# EasyEDA Pro project SourceFile.eprj

# Schematic 双轮腿-第一次量产版本
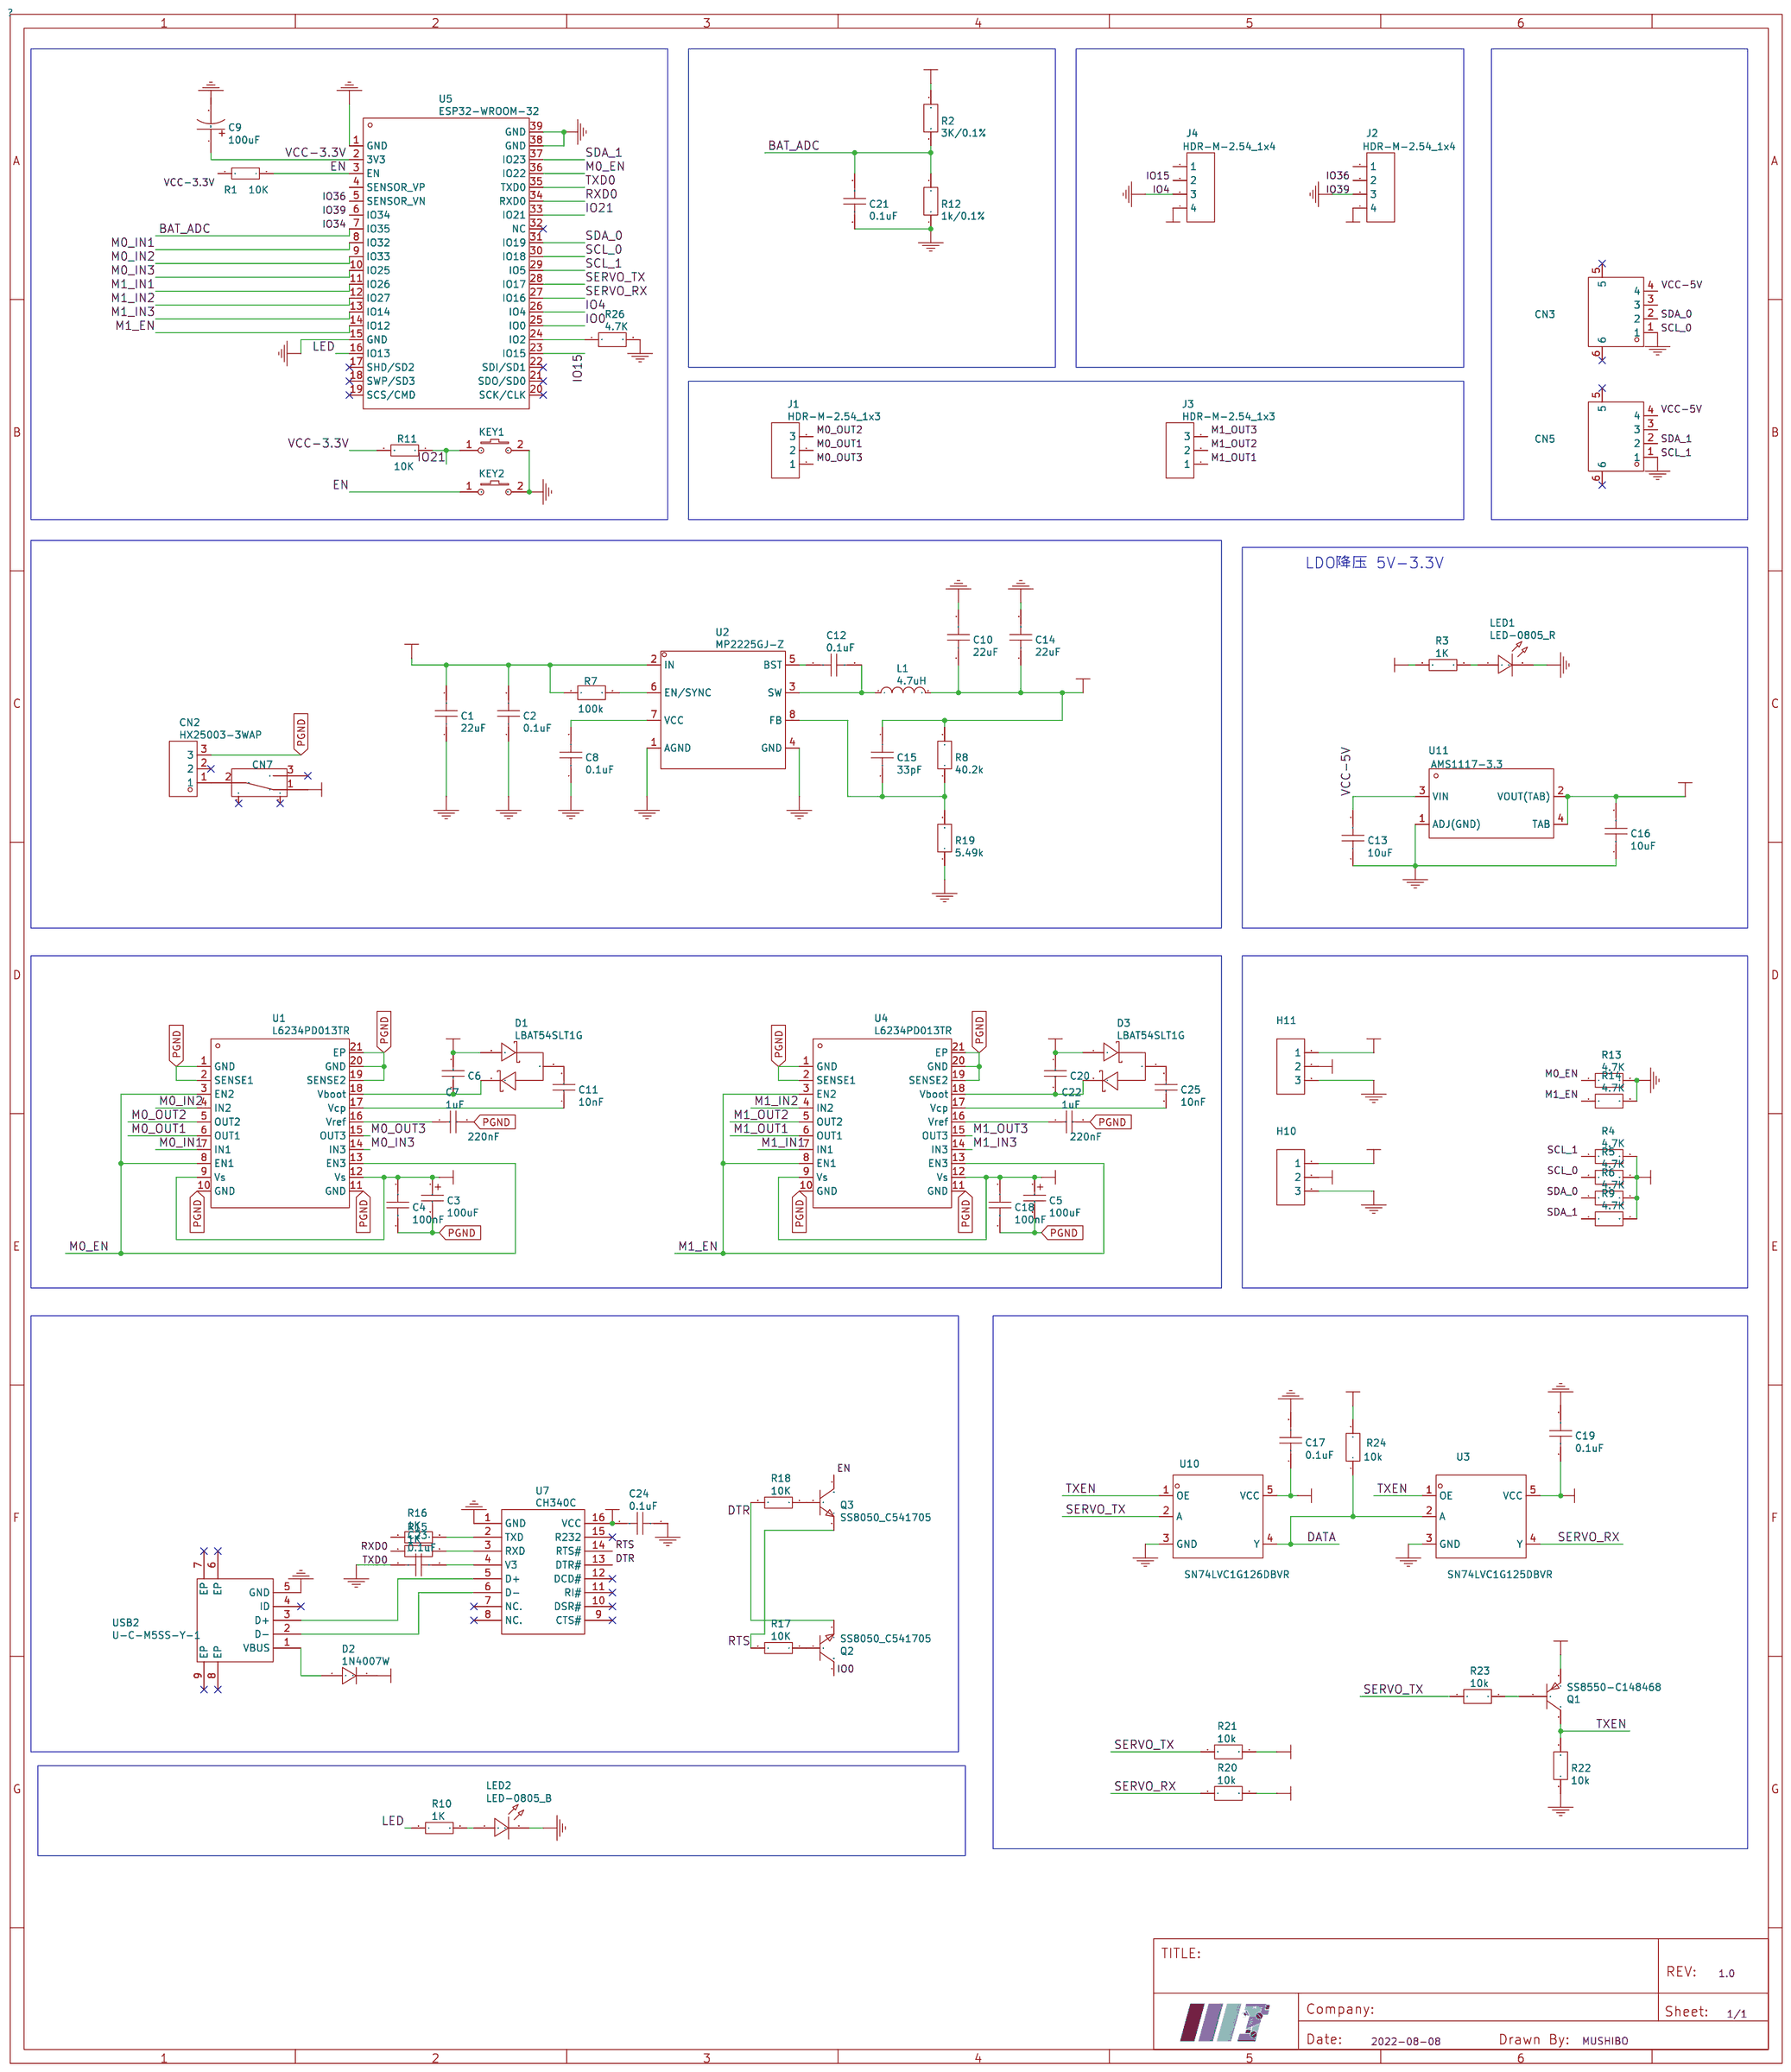
[diagram p0: schematic sheet]

## Parts
C1  22uF  [C0805]
C2  0.1uF  [C0805]
C3  100uF  [CAP-SMD_L7.3-W4.3-R-RD]
C4  100nF  [C0805]
C5  100uF  [CAP-SMD_L7.3-W4.3-R-RD]
C6  220nF  [C0805]
C7  1uF  [C0805]
C8  0.1uF  [C0805]
C9  100uF  [CAP-SMD_L3.5-W2.8-R-RD]
C10  22uF  [C0805]
C11  10nF  [C0805]
C12  0.1uF  [C0805]
C13  10uF  [C0805]
C14  22uF  [C0805]
C15  33pF  [C0805]
C16  10uF  [C0805]
C17  0.1uF  [C0805]
C18  100nF  [C0805]
C19  0.1uF  [C0805]
C20  220nF  [C0805]
C21  0.1uF  [C0805]
C22  1uF  [C0805]
C23  0.1uF  [C0805]
C24  0.1uF  [C0805]
C25  10nF  [C0805]
CN2  HX25003-3WAP  [CONN-TH_3P-P2.50_HX25003-3WAP]
CN3  A1257WV-S-4P  [CONN-SMD_A1257WV-S-4P]
CN5  A1257WV-S-4P  [CONN-SMD_A1257WV-S-4P]
CN7  SS-12D02-VG4  [SW-TH_SS-12D02-VG4]
D1  LBAT54SLT1G  [SOT-23_L2.9-W1.3-P1.90-LS2.4-BR]
D2  1N4007W  [SOD-123_L2.8-W1.8-LS3.7-RD]
D3  LBAT54SLT1G  [SOT-23_L2.9-W1.3-P1.90-LS2.4-BR]
H10  5264-3A  [CONN-TH_5264-3AW]
H11  5264-3A  [CONN-TH_5264-3AW]
J1  HDR-M-2.54_1x3  [HDR-M-2.54_1X3]
J2  HDR-M-2.54_1x4  [HDR-M-2.54_1X4]
J3  HDR-M-2.54_1x3  [HDR-M-2.54_1X3]
J4  HDR-M-2.54_1x4  [HDR-M-2.54_1X4]
KEY1  K2-3.6×6.1_SMD  [KEY-SMD_2P-L6.2-W3.6-LS8.0]
KEY2  K2-3.6×6.1_SMD  [KEY-SMD_2P-L6.2-W3.6-LS8.0]
L1  4.7uH  [IND-SMD_L7.3-W6.6]
LED1  LED-0805_R  [LED0805_RED]
LED2  LED-0805_B  [LED0805_BLUE]
Q1  SS8550-C148468  [SOT-23-3_L2.9-W1.3-P1.90-LS2.4-BR]
Q2  SS8050_C541705  [SOT-23-3_L2.9-W1.3-P1.90-LS2.4-BR]
Q3  SS8050_C541705  [SOT-23-3_L2.9-W1.3-P1.90-LS2.4-BR]
R1  10K  [R0805]
R2  3K/0.1%  [R0805]
R3  1K  [R0805]
R4  4.7K  [R0603]
R5  4.7K  [R0603]
R6  4.7K  [R0603]
R7  100k  [R0805]
R8  40.2k  [R0805]
R9  4.7K  [R0603]
R10  1K  [R0805]
R11  10K  [R0805]
R12  1k/0.1%  [R0805]
R13  4.7K  [R0603]
R14  4.7K  [R0603]
R15  1K  [R0603]
R16  1K  [R0603]
R17  10K  [R0603]
R18  10K  [R0603]
R19  5.49k  [R0805]
R20  10k  [R0805]
R21  10k  [R0805]
R22  10k  [R0805]
R23  10k  [R0805]
R24  10k  [R0805]
R26  4.7K  [R0603]
U1  L6234PD013TR  [POWERSO20_L15.9-W11.0-P1.27-LS14.2-BL-EP]
U2  MP2225GJ-Z  [TSOT-23-8_L2.9-W1.6-P0.65-LS2.8-BR]
U3  SN74LVC1G125DBVR  [SOT-23-5_L3.0-W1.7-P0.95-LS2.8-BR]
U4  L6234PD013TR  [POWERSO20_L15.9-W11.0-P1.27-LS14.2-BL-EP]
U5  ESP32-WROOM-32  [WIFIM-SMD_ESP-32S]
U7  CH340C  [SOP-16_L10.0-W3.9-P1.27-LS6.0-BL]
U10  SN74LVC1G126DBVR  [SOT-23-5_L3.0-W1.7-P0.95-LS2.8-BR]
U11  AMS1117-3.3  [SOT-223_L6.7-W3.5-P2.30-BR]
USB2  U-C-M5SS-Y-1  [MICRO-USB-SMD_U-C-M5SS-Y-1]

## Library data of the parts
C1 C10 C14 = 22uF: Supplier Part: C602037; Supplier: LCSC
C2 C8 C12 C23 C24 = 0.1uF: Supplier Part: C1525; Manufacturer: LCSC
C3 C5 = 100uF: Supplier: LCSC; Manufacturer: AVX; Manufacturer Part: TAJD107M020RNJ; Supplier Part: C99373; JLCPCB Part Class: Extended Part
C4 C18 = 100nF: Supplier: LCSC; Supplier Part: C485772; Manufacturer: HEC(Holy Stone Enterprise); Manufacturer Part: C0805X104K101T; JLCPCB Part Class: Extended Part
C6 C20 = 220nF: Supplier: LCSC; Manufacturer Part: CL21B224KBFNNNE; Manufacturer: SAMSUNG; Supplier Part: C5378; JLCPCB Part Class: Basic
C7 C22 = 1uF: Supplier: LCSC; Manufacturer Part: CL21B105KBFNNNE; Manufacturer: SAMSUNG; Supplier Part: C28323; JLCPCB Part Class: Basic
C9 = 100uF: Supplier: LCSC; Supplier Part: C140373; Manufacturer: Shenzhen Zhenhua XinYun Elec; Manufacturer Part: CA45-B-6.3V-100uF-M; JLCPCB Part Class: Extended Part
C11 C25 = 10nF: Supplier: LCSC; Manufacturer Part: CL21A106KAYNNNE; Manufacturer: SAMSUNG; Supplier Part: C15850; JLCPCB Part Class: Basic
C13 C16 = 10uF: Supplier Part: C1713; Supplier: LCSC; Manufacturer Part: CL21A106KOQNNNE; Manufacturer: SAMSUNG
C15 = 33pF: Supplier Part: C157687; Supplier: LCSC
C17 C19 C21 = 0.1uF: Supplier Part: C49678; Supplier: LCSC; Manufacturer Part: CC0805KRX7R9BB104; Manufacturer: YAGEO
CN2 = HX25003-3WAP: Supplier: LCSC; Supplier Part: C442327; Manufacturer: HX(红星); JLCPCB Part Class: Extended Part
CN3 CN5 = A1257WV-S-4P: Supplier: LCSC; Supplier Part: C225120; Manufacturer: Changjiang Connectors; JLCPCB Part Class: Extended Part
CN7 = SS-12D02-VG4: Supplier: LCSC; Supplier Part: C136719; Manufacturer: Rectangular Connectors - Contacts
D1 D3 = LBAT54SLT1G: Supplier: LCSC; Manufacturer: LRC; image: //image.lceda.cn/szlcsc/C12765.jpg; Supplier Part: C12765; JLCPCB Part Class: Extend; JLCPCB SMD: Yes
D2 = 1N4007W: Supplier: LCSC; Supplier Part: C328592; Manufacturer: BLUE ROCKET
H10 H11 = 5264-3A: Supplier Part: C146690; Supplier: LCSC
J1 J3 = HDR-M-2.54_1x3: Supplier Part: C180248; Supplier: LCSC
J2 J4 = HDR-M-2.54_1x4: Supplier Part: C124378; Supplier: LCSC
KEY1 KEY2 = K2-3.6×6.1_SMD: Supplier Part: C118141; Supplier: LCSC; Manufacturer Part: K2-1107ST-A4SW-06; 制造商: 韩国韩荣
L1 = 4.7uH: Supplier: LCSC; Supplier Part: C2937097; Manufacturer: PSA(信昌电陶); Manufacturer Part: MCS0630-4R7MPY1
LED1 = LED-0805_R: Manufacturer: EVERLIGHT(台湾亿光); Manufacturer Part: 17-21SURC/S530-A3/TR8; Supplier Part: C72037
LED2 = LED-0805_B: Manufacturer: 方舟 ARKLED; Manufacturer Part: D-B080508B1-KS2; Supplier Part: C108412
Q1 = SS8550-C148468: Supplier: LCSC; Manufacturer: Yenji; Manufacturer Part: SS8550; Supplier Part: C148468
Q2 Q3 = SS8050_C541705: Supplier: LCSC; Supplier Part: C541705; Manufacturer: AnBon; Manufacturer Part: SS8050
R1 R11 R17 R18 = 10K: Supplier: LCSC; Supplier Part: C238881; Manufacturer: Stackpole Elec; Manufacturer Part: RMCF0603JT10K0
R2 = 3K/0.1%: Supplier Part: C97164; Supplier: LCSC; Manufacturer Part: TC0525B3001T5E; Manufacturer: UniOhm
R3 R10 = 1K: Supplier: LCSC; Manufacturer: UniOhm; Manufacturer Part: 0805W8F1001T5E; Supplier Part: C17513; JLCPCB Part Class: Basic
R4-R6 R9 R13 R14 R26 = 4.7K
R7 = 100k
R8 = 40.2k
R12 = 1k/0.1%: Supplier Part: C309081; Supplier: LCSC; Manufacturer Part: ARG05BTC1001; Manufacturer: Viking Tech
R15 R16 = 1K: Supplier: LCSC; Supplier Part: C238881; Manufacturer: Stackpole Elec; Manufacturer Part: RMCF0603JT10K0
R19 = 5.49k
R20 R21 R23 R24 = 10k: Supplier Part: C17414; Supplier: LCSC; Manufacturer Part: 0805W8F1002T5E; Manufacturer: UniOhm
R22 = 10k: Supplier Part: C4328; Supplier: LCSC; Manufacturer Part: 0805W8F2002T5E; Manufacturer: UniOhm
U1 U4 = L6234PD013TR: Supplier: LCSC; Manufacturer: STMicroelectronics; Supplier Part: C77581
U2 = MP2225GJ-Z: Supplier: LCSC; Manufacturer: MPS; Supplier Part: C133066; JLCPCB Part Class: Extended Part
U3 = SN74LVC1G125DBVR: Supplier: LCSC; Manufacturer: TI; image: //image.lceda.cn/szlcsc/C23654.jpg; Supplier Part: C23654; JLCPCB Part Class: Extend
U5 = ESP32-WROOM-32: Supplier: LCSC; Supplier Part: C82899; Manufacturer: Espressif Systems; JLCPCB Part Class: Extended Part
U7 = CH340C: Supplier Part: C84681; Supplier: LCSC; Manufacturer: WCH(南京沁恒); JLCPCB Part Class: Extended Part
U10 = SN74LVC1G126DBVR: Supplier: LCSC; Manufacturer: TI; image: //image.lceda.cn/szlcsc/C23654.jpg; Supplier Part: C7834; JLCPCB Part Class: Extend
U11 = AMS1117-3.3: Supplier: LCSC; Supplier Part: C347222; Manufacturer: Youtai Semiconductor Co., Ltd.; JLCPCB Part Class: Extend
USB2 = U-C-M5SS-Y-1: Supplier: LCSC; Manufacturer: 韩国韩荣; Supplier Part: C141385; JLCPCB Part Class: Extended Part

## Nets
GND: C1.1 C2.1 C8.1 C9.2 C10.1 C13.1 C14.2 C16.1 C17.2 C19.2 C21.1 C23.2 C24.1 CN3.1 CN5.1 H10.3 H11.3 J2.3 J4.3 KEY1.2 KEY2.2 LED1.2 LED2.2 R12.1 R13.2 R14.2 R19.1 R22.1 R26.2 U2.1(AGND) U2.4(GND) U3.3(GND) U5.1(GND) U5.15(GND) U5.38(GND) U5.39(GND) U7.1(GND) U10.3(GND) U11.1(ADJ(GND)) USB2.5(GND)
PGND: C3.2 C4.1 C5.2 C7.2 C18.1 C22.2 CN2.3 U1.1(GND) U1.2(SENSE1) U1.10(GND) U1.11(GND) U1.19(SENSE2) U1.20(GND) U1.21(EP) U4.1(GND) U4.2(SENSE1) U4.10(GND) U4.11(GND) U4.19(SENSE2) U4.20(GND) U4.21(EP)
VCC-3.3V: C9.1 C16.2 C17.1 C19.1 C24.2 Q1.2(E) R1.2 R3.1 R4.2 R5.2 R6.2 R9.2 R11.2 R20.2 R21.1 R24.2 U3.5(VCC) U5.2(3V3) U7.16(VCC) U10.5(VCC) U11.2(VOUT(TAB)) U11.4(TAB)
VCC-5V: C10.2 C13.2 C14.1 C15.1 CN3.4 CN5.4 D2.1 J2.4 J4.4 L1.2 R8.2 U11.3(VIN)
VIN: C1.2 C2.2 C3.1 C4.2 C5.1 C6.1 C18.2 C20.1 CN7.1 D1.1(A) D3.1(A) H10.2 H11.2 R2.2 R7.1 U1.9(Vs) U1.12(Vs) U2.2(IN) U4.9(Vs) U4.12(Vs)
BAT_ADC: C21.2 R2.1 R12.2 U5.7(IO35)
DATA: H10.1 H11.1 R24.1 U3.2(A) U10.4(Y)
DTR: Q2.2(E) R18.2 U7.13(DTR#)
EN: KEY2.1 Q3.3(C) R1.1 U5.3(EN)
IO0: Q2.3(C) U5.25(IO0)
IO4: J4.2 U5.26(IO4)
IO15: J4.1 U5.23(IO15)
IO21: KEY1.1 R11.1 U5.33(IO21)
IO34: U5.6(IO34)
IO36: J2.1 U5.4(SENSOR_VP)
IO39: J2.2 U5.5(SENSOR_VN)
LED: R10.1 U5.16(IO13)
M0_EN: R13.1 U1.3(EN2) U1.8(EN1) U1.13(EN3) U5.36(IO22)
M0_IN1: U1.7(IN1) U5.8(IO32)
M0_IN2: U1.4(IN2) U5.9(IO33)
M0_IN3: U1.14(IN3) U5.10(IO25)
M0_OUT1: J1.2 U1.6(OUT1)
M0_OUT2: J1.3 U1.5(OUT2)
M0_OUT3: J1.1 U1.15(OUT3)
M1_EN: R14.1 U4.3(EN2) U4.8(EN1) U4.13(EN3) U5.14(IO12)
M1_IN1: U4.7(IN1) U5.11(IO26)
M1_IN2: U4.4(IN2) U5.12(IO27)
M1_IN3: U4.14(IN3) U5.13(IO14)
M1_OUT1: J3.1 U4.6(OUT1)
M1_OUT2: J3.2 U4.5(OUT2)
M1_OUT3: J3.3 U4.15(OUT3)
RTS: Q3.2(E) R17.2 U7.14(RTS#)
RXD0: R16.1 U5.34(RXD0)
SCL_0: CN3.2 R5.1 U5.30(IO18)
SCL_1: CN5.2 R4.1 U5.29(IO5)
SDA_0: CN3.3 R6.1 U5.31(IO19)
SDA_1: CN5.3 R9.1 U5.37(IO23)
SERVO_RX: R20.1 U3.4(Y) U5.27(IO16)
SERVO_TX: R21.2 R23.1 U5.28(IO17) U10.2(A)
TXD0: R15.1 U5.35(TXD0)
TXEN: Q1.3(C) R22.2 U3.1(OE) U10.1(OE)
CN2_1: CN2.1 CN7.2
D1_3: C11.2 D1.3(AK)
D3_3: C25.2 D3.3(AK)
Q1_1: Q1.1(B) R23.2
R3_2: LED1.1 R3.2
R10_2: LED2.1 R10.2
R17_1: Q2.1(B) R17.1
R18_1: Q3.1(B) R18.1
U1_16: C7.1 U1.16(Vref)
U1_17: C11.1 U1.17(Vcp)
U1_18: C6.2 D1.2(K) U1.18(Vboot)
U2_3: C12.1 L1.1 U2.3(SW)
U2_5: C12.2 U2.5(BST)
U2_6: R7.2 U2.6(EN/SYNC)
U2_7: C8.2 U2.7(VCC)
U2_8: C15.2 R8.1 R19.2 U2.8(FB)
U4_16: C22.1 U4.16(Vref)
U4_17: C25.1 U4.17(Vcp)
U4_18: C20.2 D3.2(K) U4.18(Vboot)
U5_24: R26.1 U5.24(IO2)
U7_2: R16.2 U7.2(TXD)
U7_3: R15.2 U7.3(RXD)
U7_4: C23.1 U7.4(V3)
USB2_1: D2.2 USB2.1(VBUS)
USB2_2: U7.6(D-) USB2.2(D-)
USB2_3: U7.5(D+) USB2.3(D+)

Not connected (* = marked no-connect by the designer): CN2 2*; CN3 5* 6*; CN5 5* 6*; CN7 3* 4* 5*; U5 17(SHD/SD2)* 18(SWP/SD3)* 19(SCS/CMD)* 20(SCK/CLK)* 21(SDO/SD0)* 22(SDI/SD1)* 32(NC)*; U7 7(NC.)* 8(NC.)* 9(CTS#)* 10(DSR#)* 11(RI#)* 12(DCD#)* 15(R232)*; USB2 4(ID)* 6(EP)* 7(EP)* 8(EP)* 9(EP)*

## Notes on the sheet
- LDO降压 5V-3.3V

# Board PCB_WLRobot
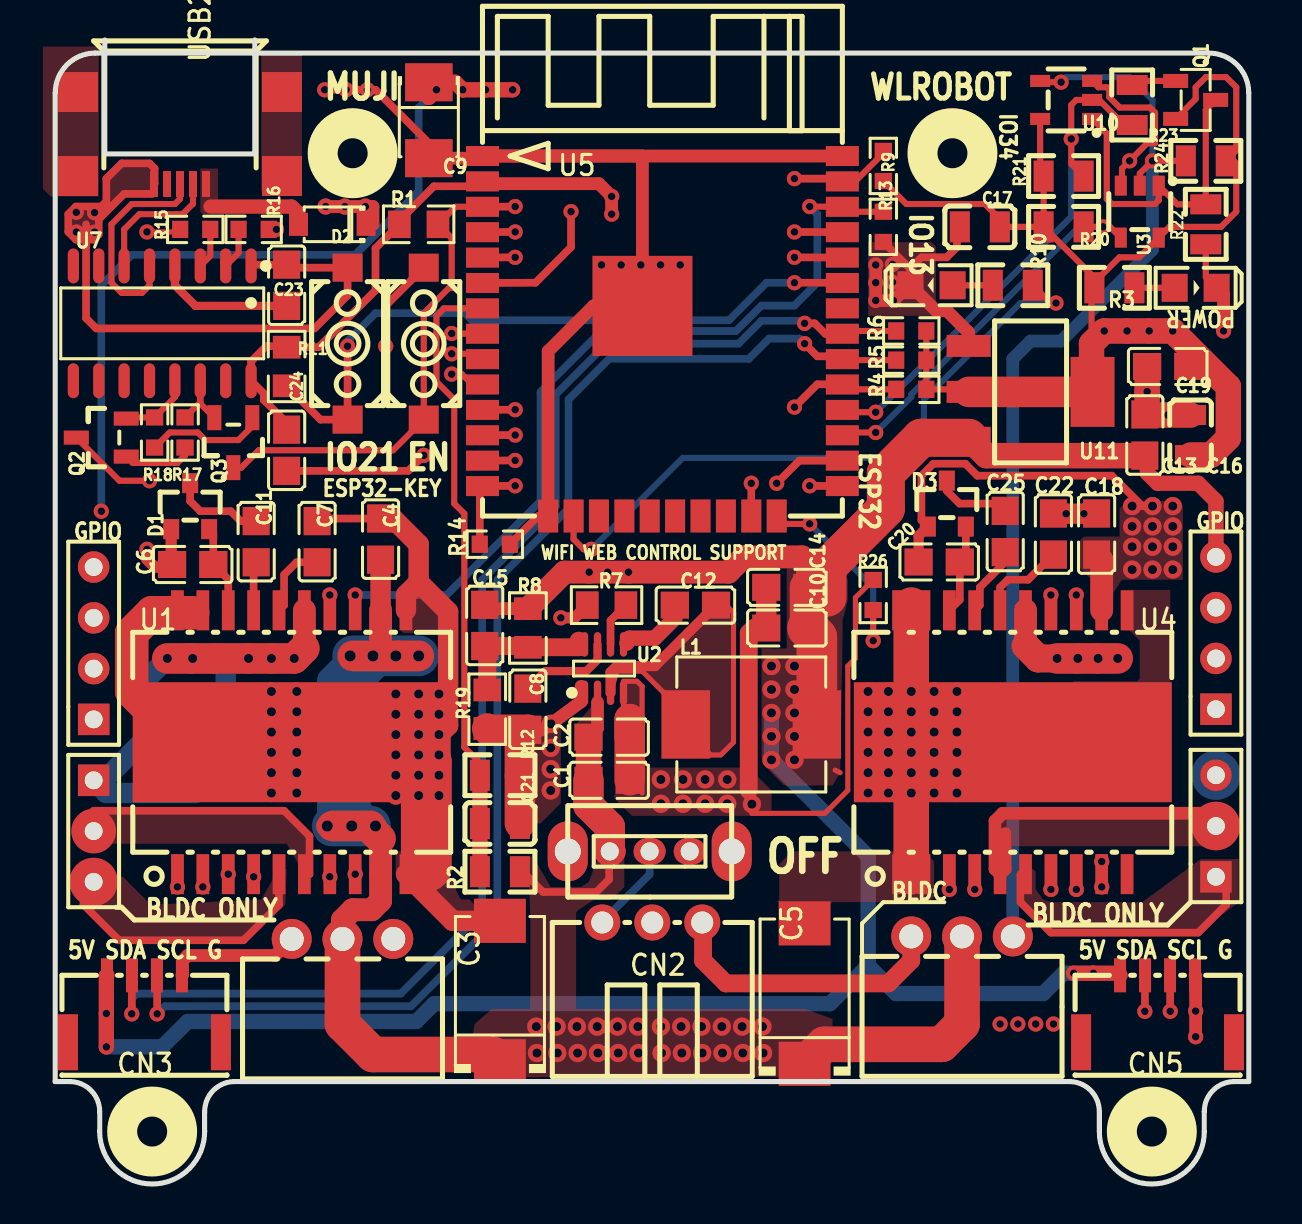
[diagram p1: board, top side]
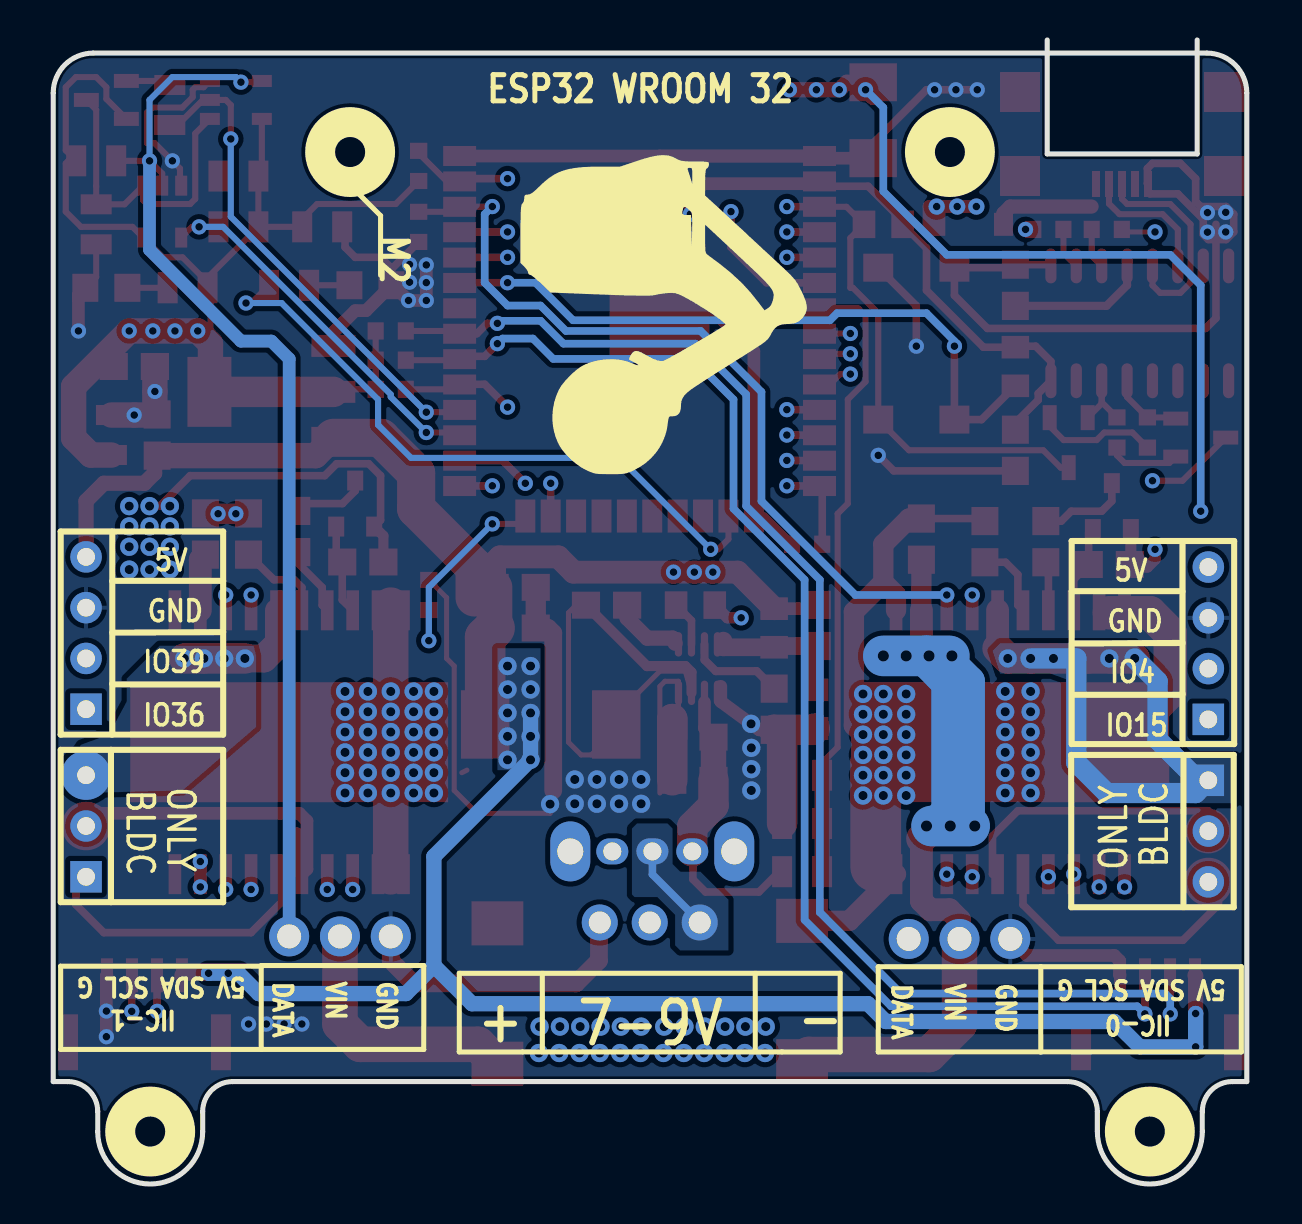
[diagram p2: board, bottom side, seen from below]

Outline 59.7 x 57.23 mm; copper layers: Top Layer, Inner1, Inner2, Bottom Layer. Coordinates in mm from the lower left corner of the outline.
Outline path: 0,54.57 0,5.12 0.73,5.12 arc(1.79,4.69) 2.23,3.62 2.23,2.62 arc(4.85,0) 7.48,2.62 7.48,3.62 arc(7.91,4.69) 8.97,5.12 50.72,5.12 arc(51.79,4.69) 52.22,3.62 52.22,2.62 arc(54.85,0) 57.47,2.62 57.47,3.62 arc(57.91,4.69) 58.97,5.12 59.7,5.12 59.7,54.57 arc(59.11,55.99) 57.7,56.57 2,56.57 arc(0.59,55.99) 0,54.57
Stack: Top Layer 0.035mm / Dielectric1 0.48mm PP er 4.5 / Inner1 0.035mm / Dielectric2 0.48mm FR4 er 4.5 / Inner2 0.035mm / Dielectric3 0.48mm PP er 4.5 / Bottom Layer 0.035mm

## Design rules (mm)
spacing Default (default): track to track 0.152, other pairs 0 to 0.152
track width Default (default): min 0.254, default 0.254, max 25.4
differential pair differentialPair (default): width min 0.127, default 0.254, max 2.54; gap min 0.152, default 0.152
via Default (default): diameter min 0.61, default 0.61, max 100.025; hole min 0.305, default 0.305, max 59.995
pour e116 uses gge147748
pour e313 uses gge147355

## Placement (name value [footprint] x y rotation side)
C1  22uF  [C0805]  27.71 20.2 180 top
C2  0.1uF  [C0805]  27.71 22.35 180 top
C3  100uF  [CAP-SMD_L7.3-W4.3-R-RD]  22.24 9.65 270 top
C4  100nF  [C0805]  16.28 32.26 270 top
C5  100uF  [CAP-SMD_L7.3-W4.3-R-RD]  37.48 9.53 270 top
C6  220nF  [C0805]  6.88 30.99 0 top
C7  1uF  [C0805]  13.1 32.13 90 top
C8  0.1uF  [C0805]  23.64 23.75 90 top
C9  100uF  [CAP-SMD_L3.5-W2.8-R-RD]  18.69 53.22 90 top
C10  22uF  [C0805]  36.59 27.82 0 top
C11  10nF  [C0805]  10.05 32.13 90 top
C12  0.1uF  [C0805]  32.02 28.96 180 top
C13  10uF  [C0805]  54.5 37.47 270 top
C14  22uF  [C0805]  36.59 29.85 180 top
C15  33pF  [C0805]  21.48 27.94 270 top
C16  10uF  [C0805]  55.65 40.9 0 top
C17  0.1uF  [C0805#2]  46.25 47.88 180 top
C18  100nF  [C0805]  52.09 32.51 270 top
C19  0.1uF  [C0805#2]  56.79 37.47 90 top
C20  220nF  [C0805]  44.22 31.12 0 top
C21  0.1uF  [C0805#2]  22.24 18.04 180 top
C22  1uF  [C0805]  49.93 32.51 90 top
C23  0.1uF  [C0805]  11.58 44.96 90 top
C24  0.1uF  [C0805]  11.58 36.71 90 top
C25  10nF  [C0805]  47.52 32.64 90 top
CN2  HX25003-3WAP  [CONN-TH_3P-P2.50_HX25003-3WAP]  29.86 13.08 0 top
CN3  A1257WV-S-4P  [CONN-SMD_A1257WV-S-4P]  4.46 8.77 0 top
CN5  A1257WV-S-4P  [CONN-SMD_A1257WV-S-4P]  55.14 8.77 0 top
CN7  SS-12D02-VG4  [SW-TH_SS-12D02-VG4]  29.74 16.64 0 top
D1  LBAT54SLT1G  [SOT-23_L2.9-W1.3-P1.90-LS2.4-BR]  6.75 33.91 270 top
D2  1N4007W  [SOD-123_L2.8-W1.8-LS3.7-RD]  13.86 48.01 180 top
D3  LBAT54SLT1G  [SOT-23_L2.9-W1.3-P1.90-LS2.4-BR]  44.6 34.04 270 top
H10  5264-3A  [CONN-TH_5264-3AW]  14.37 11.56 0 top
H11  5264-3A  [CONN-TH_5264-3AW]  45.36 11.69 0 top
J1  HDR-M-2.54_1x3  [HDR-M-2.54_1X3]  1.92 17.66 270 top
J2  HDR-M-2.54_1x4  [HDR-M-2.54_1X4]  58.06 27.56 90 top
J3  HDR-M-2.54_1x3  [HDR-M-2.54_1X3]  58.06 17.91 90 top
J4  HDR-M-2.54_1x4  [HDR-M-2.54_1X4]  1.92 27.05 90 top
KEY1  K2-3.6×6.1_SMD  [KEY-SMD_2P-L6.2-W3.6-LS8.0]  14.62 42.04 90 top
KEY2  K2-3.6×6.1_SMD  [KEY-SMD_2P-L6.2-W3.6-LS8.0]  18.43 42.04 90 top
L1  4.7uH  [IND-SMD_L7.3-W6.6]  34.82 22.99 180 top
LED1  LED-0805_R  [LED0805_RED]  57.04 44.83 0 top
LED2  LED-0805_B  [LED0805_BLUE]  43.83 44.96 180 top
Q1  SS8550-C148468  [SOT-23-3_L2.9-W1.3-P1.90-LS2.4-BR#2]  57.04 54.23 180 top
Q2  SS8050_C541705  [SOT-23-3_L2.9-W1.3-P1.90-LS2.4-BR]  2.31 37.34 0 top
Q3  SS8050_C541705  [SOT-23-3_L2.9-W1.3-P1.90-LS2.4-BR]  8.91 37.09 90 top
R1  10K  [R0805#2]  18.18 48.01 180 top
R2  3K/0.1%  [R0805]  22.24 15.62 0 top
R3  1K  [R0805]  52.98 44.83 0 top
R4  4.7K  [R0603]  42.82 39.75 0 top
R5  4.7K  [R0603]  42.82 41.21 0 top
R6  4.7K  [R0603]  42.82 42.67 0 top
R7  100k  [R0805#2]  27.58 28.96 0 top
R8  40.2k  [R0805#2]  23.64 27.82 90 top
R9  4.7K  [R0603]  41.42 50.93 270 top
R10  1K  [R0805]  47.9 44.96 180 top
R11  10K  [R0805#2]  11.58 40.9 90 top
R12  1k/0.1%  [R0805]  22.24 20.45 180 top
R13  4.7K  [R0603]  41.42 47.88 270 top
R14  4.7K  [R0603]  21.99 32.01 0 top
R15  1K  [R0603]  7 47.75 0 top
R16  1K  [R0603]  9.93 47.75 180 top
R17  10K  [R0603]  6.5 37.59 90 top
R18  10K  [R0603]  4.97 37.59 90 top
R19  5.49k  [R0805#2]  21.61 23.75 90 top
R20  10k  [R0805]  50.44 47.88 180 top
R21  10k  [R0805]  50.44 50.42 0 top
R22  10k  [R0805]  57.55 48.01 90 top
R23  10k  [R0805]  53.87 53.98 90 top
R24  10k  [R0805]  57.55 51.18 0 top
R26  4.7K  [R0603]  40.91 29.47 90 top
U1  L6234PD013TR  [POWERSO20_L15.9-W11.0-P1.27-LS14.2-BL-EP]  11.83 22.1 0 top
U2  MP2225GJ-Z  [TSOT-23-8_L2.9-W1.6-P0.65-LS2.8-BR]  27.45 25.78 270 top
U3  SN74LVC1G125DBVR  [SOT-23-5_L3.0-W1.7-P0.95-LS2.8-BR]  54.25 48.64 90 top
U4  L6234PD013TR  [POWERSO20_L15.9-W11.0-P1.27-LS14.2-BL-EP]  47.9 22.1 0 top
U5  ESP32-WROOM-32  [WIFIM-SMD_ESP-32S]  30.37 42.42 270 top
U7  CH340C  [SOP-16_L10.0-W3.9-P1.27-LS6.0-BL]  5.35 43.06 180 top
U10  SN74LVC1G126DBVR  [SOT-23-5_L3.0-W1.7-P0.95-LS2.8-BR]  50.56 54.23 0 top
U11  AMS1117-3.3  [SOT-223_L6.7-W3.5-P2.30-BR]  48.79 39.63 180 top
USB2  U-C-M5SS-Y-1  [MICRO-USB-SMD_U-C-M5SS-Y-1]  6.24 52.33 270 top

## Footprints (pads in the part's own frame, mm; a bottom-side part is the same pattern mirrored in y, then rotated)
C0805
  rect 1.41x1.35 smd: 1(-1.03,0) 2(1.03,0)
C0805#2
  rect 1x1.55 smd: 1(-1,0) 2(1,0)
CAP-SMD_L3.5-W2.8-R-RD
  rect 1.9x2.376 smd: 1(1.899,0) 2(-1.899,0)
CAP-SMD_L7.3-W4.3-R-RD
  rect 2.208x2.592 smd: 1(3.511,0) 2(-3.511,0)
CONN-SMD_A1257WV-S-4P
  rect 0.6x1.7 smd: 1(1.875,1.675) 2(0.625,1.675) 3(-0.625,1.675) 4(-1.875,1.675)
  rect 1x2.8 smd: 5(3.825,-1.675) 6(-3.825,-1.675)
CONN-TH_3P-P2.50_HX25003-3WAP
  round 1.8 hole 1.1: 1(-2.5,0) 2(0.001,0) 3(2.5,0)
CONN-TH_5264-3AW
  round 2 hole 1.2: 1(2.54,0.7) 2(0,0.7) 3(-2.54,0.7)
HDR-M-2.54_1X3
  rect 1.575x1.575 hole 0.889: 1(-2.54,0)
  round 1.575 hole 0.889: 2(0,0) 3(2.54,0)
HDR-M-2.54_1X4
  rect 1.575x1.575 hole 0.889: 1(-3.81,0)
  round 1.575 hole 0.889: 2(-1.27,0) 3(1.27,0) 4(3.81,0)
IND-SMD_L7.3-W6.6
  rect 2.424x3.42 smd: 1(3.278,0) 2(-3.278,0)
KEY-SMD_2P-L6.2-W3.6-LS8.0
  rect 1.4x1.5 smd: 1(-3.8,0) 2(3.8,0)
LED0805_BLUE
  rect 1.3x1.399 smd: 1(-1.05,0) 2(1.05,0)
LED0805_RED
  rect 1.3x1.399 smd: 1(-1.05,0) 2(1.05,0)
MICRO-USB-SMD_U-C-M5SS-Y-1
  rect 1.3x0.4 smd: 1(2.3,1.3) 2(2.3,0.65) 3(2.3,0) 4(2.3,-0.65) 5(2.3,-1.3)
  rect 2x1.999 smd: 6(-2.3,5.1) 7(1.9,5.1) 8(1.9,-5.1) 9(-2.3,-5.1)
POWERSO20_L15.9-W11.0-P1.27-LS14.2-BL-EP
  rect 0.635x2 smd: 1(-5.715,-6.6) 2(-4.445,-6.6) 3(-3.175,-6.6) 4(-1.905,-6.6) 5(-0.635,-6.6) 6(0.635,-6.6) 7(1.905,-6.6) 8(3.175,-6.6) 9(4.445,-6.6) 10(5.715,-6.6) 11(5.715,6.6) 12(4.445,6.6) 13(3.175,6.6) 14(1.905,6.6) 15(0.635,6.6) 16(-0.635,6.6) 17(-1.905,6.6) 18(-3.175,6.6) 19(-4.445,6.6) 20(-5.715,6.6)
  rect 15.9x6 smd: 21(0,0)
R0603
  rect 0.806x0.864 smd: 1(-0.753,0) 2(0.753,0)
R0805
  rect 1x1.55 smd: 1(-1,0) 2(1,0)
R0805#2
  rect 1.133x1.377 smd: 1(-0.966,0) 2(0.966,0)
SOD-123_L2.8-W1.8-LS3.7-RD
  rect 0.95x1.15 smd: 1(-1.692,0) 2(1.692,0)
SOP-16_L10.0-W3.9-P1.27-LS6.0-BL
  oval 0.56x1.745 smd: 1(-4.445,-2.873) 2(-3.175,-2.873) 3(-1.905,-2.873) 4(-0.635,-2.873) 5(0.635,-2.873) 6(1.905,-2.873) 7(3.175,-2.873) 8(4.445,-2.873) 9(4.445,2.873) 10(3.175,2.873) 11(1.905,2.873) 12(0.635,2.873) 13(-0.635,2.873) 14(-1.905,2.873) 15(-3.175,2.873) 16(-4.445,2.873)
SOT-23-3_L2.9-W1.3-P1.90-LS2.4-BR
  rect 1.25x0.7 smd: 1(1.25,-0.95) 2(1.25,0.95) 3(-1.25,0)
SOT-23-3_L2.9-W1.3-P1.90-LS2.4-BR#2
  rect 1.25x0.7 smd: 1(1,-0.95) 2(1,0.95) 3(-1,0)
SOT-23-5_L3.0-W1.7-P0.95-LS2.8-BR
  rect 1x0.6 smd: 1(1.3,-0.95) 2(1.3,0) 3(1.3,0.95) 4(-1.3,0.95) 5(-1.3,-0.95)
SOT-23_L2.9-W1.3-P1.90-LS2.4-BR
  rect 1x0.8 smd: 1(1.15,-0.95) 2(1.15,0.95) 3(-1.15,0)
SOT-223_L6.7-W3.5-P2.30-BR
  rect 2.2x1.1 smd: 1(3.099,-2.3) 2(3.099,0) 3(3.099,2.3)
  rect 2.2x3.5 smd: 4(-3.099,0)
SW-TH_SS-12D02-VG4
  oval 1.6x1.3 hole 0.9: 1(-2,0) 2(-0.006,0) 3(2,0)
  oval 2x3 hole 1.3: 4(4.1,0) 5(-4.1,0)
TSOT-23-8_L2.9-W1.6-P0.65-LS2.8-BR
  oval 1.222x0.364 smd: 1(1.211,-0.975) 2(1.211,-0.325) 3(1.211,0.325) 4(1.211,0.975) 5(-1.211,0.975) 6(-1.211,0.325) 7(-1.211,-0.325) 8(-1.211,-0.975)
WIFIM-SMD_ESP-32S
  rect 1x1.65 smd: 1(-9.005,-9) 2(-7.735,-9) 3(-6.465,-9) 4(-5.195,-9) 5(-3.925,-9) 6(-2.655,-9) 7(-1.385,-9) 8(-0.115,-9) 9(1.155,-9) 10(2.425,-9) 11(3.695,-9) 12(4.965,-9) 13(6.235,-9) 14(7.505,-9) 25(7.505,9) 26(6.235,9) 27(4.965,9) 28(3.695,9) 29(2.425,9) 30(1.155,9) 31(-0.115,9) 32(-1.385,9) 33(-2.655,9) 34(-3.925,9) 35(-5.195,9) 36(-6.465,9) 37(-7.735,9) 38(-9.005,9)
  rect 1.65x1 smd: 15(9.005,-5.715) 16(9.005,-4.445) 17(9.005,-3.175) 18(9.005,-1.905) 19(9.005,-0.635) 20(9.005,0.635) 21(9.005,1.905) 22(9.005,3.175) 23(9.005,4.445) 24(9.005,5.715)
  rect 5x5 smd: 39(-1.51,-1)

## Nets
As in the schematic, except:
PGND: C3.2 C4.1 C5.2 C7.2 C18.1 C22.2 CN2.3 U1.1 U1.2 U1.10 U1.11 U1.19 U1.20 U1.21 U4.1 U4.2 U4.11 U4.19 U4.20 U4.21

Pads without a net: CN2 2; CN3 5 6; CN5 5 6; CN7 3 4 5; U4 10; U5 17 18 19 20 21 22 32; U7 7 8 9 10 11 12 15; USB2 4 6 7 8 9

## Via types
v1: diameter 0.914, hole 0.457, Top Layer to Bottom Layer, 128 vias
v2: diameter 0.762, hole 0.381, Top Layer to Bottom Layer, 108 vias
v3: diameter 0.813, hole 0.381, Top Layer to Bottom Layer, 3 vias
v4: diameter 1.117, hole 0.559, Top Layer to Bottom Layer, 7 vias

## Routing (per net, layer and track width the routed paths; a pad name or vN(x,y) marks a point on that pad's centre or on a via; arc(x,y) is an arc through that point)
GND: length 205.6
  Top Layer w0.254: 28.43,24.57 28.43,25.15 29.1,25.15 29.36,24.89 29.36,19.56 ; 40.91,30.22 40.02,29.33 40.02,26.29 39.64,25.91 39.64,19.69 38.5,18.54 34.85,18.54 v1(34.85,19) ; C2.1 28.74,23.06 28.43,23.37 U2.4
  Top Layer w0.305: LED1.2 57.55,45.38 R22.1 ; U3.3 53.36,50 53.36,50.8 v2(53.74,51.18) 54.63,52.07 55.01,52.07 55.01,53.6 54.76,53.85 53.25,53.85 52.72,54.37 52.72,54.74 52.6,54.87 52.18,54.87 U10.3
  Top Layer w0.381: C17.2 45.1,47.74 45.1,46.87 44.6,46.36 43.33,46.36 42.78,45.82 LED2.2 42.78,45.77 R13.2 ; 18.69,51.32 18.69,52.07 16.02,54.74 v2(15.62,54.74) v2(14.55,54.74) 13.86,54.74 ; U5.15 24.15,33.42 R14.2 ; v2(18.43,36.45) 17.66,35.68 C24.1 ; U7.1 9.86,45.99 C23.2 11.73,45.84 KEY1.2 14.62,44.45 12.97,42.8 2.05,42.8 1.54,43.31 1.54,48.01 ; KEY2.2 16.53,43.93 v2(16.53,41.91) ; 2.18,48.26 3.45,49.53 4.84,49.53 4.94,49.63 4.94,50.03 4.97,50.06 4.97,50.8 4.72,51.06 3.32,51.06 2.56,50.29 2.56,49.15 2.31,48.9 1.04,48.9 0.65,48.52 0.65,47.63 1.04,47.25 1.92,47.25 2.18,47.5 2.18,48.26
  Top Layer w0.635: U5.38 U5.1 ; U5.1 21.26,51.32 C9.2 ; U5.1 29.37,51.43 29.37,43.93 ; LED1.2 58.44,44.49 v2(58.44,42.67) ; v2(57.04,7.37) v2(57.04,8.65) 57.04,10.41 CN5.1 ; v2(41.04,45.98) v2(41.04,45.09) v2(41.04,44.2) v2(41.93,44.2) 42.69,44.96 LED2.2 ; 11.83,12.26 11,11.43 6.62,11.43 6.37,11.18 6.37,10.47 6.34,10.44 ; C8.1 24.39,22.72 26.31,24.13 26.31,24.89 ; 42.78,44.96 44.05,43.69 44.6,43.69 45.69,42.6 U11.1 ; U5.15 24.66,41.66 26.93,43.93 U5.39
  Top Layer w0.889: 35.57,27.82 34.94,27.82 34.69,27.56 34.69,19.69
  Top Layer w1.016: C14.2 C10.1
  Top Layer w1.27: C19.2 v2(55.65,38.47) 54.53,38.47 C13.1 54.62,38.61 v2(54.62,39.65) C16.1
  Top Layer w1.524: C2.1 28.74,23.26 C1.1 ; R19.1 21.67,22.72 C8.1 23.24,22.32 R12.1 C21.1
  vias: v1(24.8,23.02) v1(24.78,21.82) v1(24.78,20.75) v1(24.78,19.69) v1(30.29,20.24) v1(30.29,19.02) v1(31.4,20.24) v1(31.4,19.02) v1(32.51,20.24) v1(32.51,19.02) v1(33.61,20.24) v1(33.61,19.02) v2(1.05,48.61) v2(1.05,47.63) v2(1.97,48.59) v2(1.97,47.62) v2(13.48,54.74) v2(27.32,45.98) v2(28.31,45.98) v2(29.29,45.98) v2(30.28,45.98) v2(31.26,45.98) v2(41.88,46) v2(41.88,45.11) v2(47.26,8) v2(48.15,8) v2(49.04,8) v2(49.93,8)
PGND: length 213.4
  Top Layer w0.381: C7.2 13.23,33.29 C4.1
  Top Layer w0.889: CN2.3 32.4,13.04 32.4,11.18 33.55,10.04 41.68,10.04 42.82,11.18 42.82,12.39
  Top Layer w1.016: 18.18,30.1 18.18,32.01 16.9,33.29 C4.1 ; 18.18,30.1 17.55,29.47 U1.11 ; 18.18,30.1 19.65,28.63 19.65,22.94 v1(19.2,22.48) ; C18.1 52.08,33.53 v2(51.45,33.53) v2(50.56,33.53) 49.94,33.53 C22.2 ; U1.10 19.88,13.17 C3.2
  Top Layer w1.677: U1.21 6.37,22.1 3.83,24.64 3.83,27.56 4.84,28.58 6.88,28.58
  Top Layer w1.778: 42.82,15.37 42.82,28.96
  Top Layer w2.54: v1(18.18,21.47) 18.56,21.08 18.56,15.88
  Inner1 w0.305: v1(10.81,24.64) 10.94,24.51 v1(19.2,24.51) 23.64,20.07 23.64,13.97 25.93,11.69 34.82,11.69 37.99,14.86 37.99,24.89 38.25,25.15 44.98,25.15 45.1,25.02 v1(45.1,24.64) v1(45.1,19.56) 43.71,18.16 43.71,15.37 42.31,13.97 41.55,13.97 41.04,13.46 41.04,10.42 39.52,8.89 21.99,8.89 18.31,12.58 18.31,16.89 15.64,19.56 v1(10.81,19.56)
  Inner1 w1.27: 18.94,14.1 8.15,14.1 v2(7.39,14.86)
  Inner1 w1.524: v2(6.12,14.86) v2(7.39,14.86)
  Inner2 w1.016: v2(51.45,33.53) 46.75,33.53 42.82,29.59 v1(42.82,23.62)
  vias: v1(10.81,23.62) v1(10.81,22.61) v1(10.81,21.59) v1(10.81,20.58) v1(12.08,24.64) v1(12.08,23.62) v1(12.08,22.61) v1(12.08,21.59) v1(12.08,20.58) v1(12.08,19.56) v1(17.04,24.51) v1(17.04,23.5) v1(17.04,22.48) v1(17.04,21.47) v1(17.04,20.45) v1(17.04,19.43) v1(18.18,24.51) v1(18.18,23.5) v1(18.18,22.48) v1(18.18,20.45) v1(18.18,19.43) v1(19.2,23.5) v1(19.2,21.47) v1(19.2,20.45) v1(19.2,19.43) v1(40.66,24.64) v1(40.66,23.62) v1(40.66,22.61) v1(40.66,21.59) v1(40.66,20.58) v1(40.66,19.56) v1(41.68,24.64) v1(41.68,23.62) v1(41.68,22.61) v1(41.68,21.59) v1(41.68,20.58) v1(41.68,19.56) v1(42.82,24.64) v1(42.82,22.61) v1(42.82,21.59) v1(42.82,20.58) v1(42.82,19.56) v1(43.96,24.64) v1(43.96,23.62) v1(43.96,22.61) v1(43.96,21.59) v1(43.96,20.58) v1(43.96,19.56) v1(45.1,23.62) v1(45.1,22.61) v1(45.1,21.59) v1(45.1,20.58)
VCC-3.3V: length 183.8
  Top Layer w0.305: 51.84,42.04 51.84,44.69 R3.1 ; U10.5 49.27,50.59 R21.1 R20.2 ; R9.2 42.57,49.02 46.5,49.02 47.25,48.28 C17.1 R20.2 ; R3.1 51.98,45.1 53.23,46.36 54.21,46.36 U3.5 55.74,47.88 58.31,47.88 59.07,48.64 59.07,51.06 58.95,51.18 58.55,51.18 ; R3.1 51.98,45.34 R20.2 ; Q1.2 57.04,54.28 57.04,54.87 57.55,55.37 58.57,55.37 59.07,54.87 59.07,51.71 R24.2 ; R6.2 R5.2 R4.2 45.56,39.75 U11.2
  Top Layer w0.381: C24.2 11.58,38.08 10.43,39.22 10.43,39.55 U7.16 9.8,41.15 10.56,41.91 11.53,41.91 R11.2 13.18,41.86 16.02,44.71 16.02,46.82 R1.2 17.21,48.19 18.94,49.91 21.13,49.91 U5.2
  Top Layer w0.635: U5.2 21.49,50.04 27.2,50.04 v2(27.83,49.41) v2(27.83,48.52)
  Top Layer w0.762: v2(22.88,54.74) v2(21.53,54.74) v2(20.38,54.74) 20.01,55.11 C9.1 18.69,54.36 v2(19.07,54.74)
  Top Layer w1.27: U11.4 51.84,39.68 51.84,42.04 v2(52.47,42.67) v2(53.61,42.67) v2(54.72,42.67) v2(55.9,42.67) 58.68,39.9 58.68,37.33 57.82,36.47 56.79,36.47
  Top Layer w1.524: U11.2 U11.4
  Inner1 w0.635: 27.77,51.95 27.77,49.47 v2(27.83,49.41) v2(27.83,48.52)
  Inner1 w1.016: v2(55.9,42.67) v2(52.47,42.67) 46.25,42.67 45.23,43.69 45.23,45.72 39.01,51.95 25.8,51.95 23.01,54.74 v2(19.07,54.74)
  Bottom Layer w0.381: v2(19.07,54.74) 18.18,53.85 18.18,49.66 15,46.48 3.83,46.48 2.31,44.96 v2(2.31,33.66)
VCC-5V: length 195.6
  Top Layer w0.254: 39.26,20.58 39.01,20.7
  Top Layer w0.635: R8.2 21.67,28.78 C15.1 ; D2.1 15.89,48.01 15.89,48.9 v3(15.51,48.9) v3(13.53,48.9)
  Top Layer w0.762: CN5.4 53.16,10.54 v2(51.93,10.54) v2(50.95,10.54) ; v2(2.56,6.86) v2(2.56,8.53) 2.56,10.41 CN3.4 ; C13.2 54.63,36.31 54.63,35.56 55.14,35.06 57.17,35.06 58.06,34.17 J2.4
  Top Layer w1.143: R8.2 25.47,30.61 v2(26.71,30.61) v2(27.63,30.61) v2(28.68,30.61) 33.67,30.61 34.44,31.37 37.36,31.37 37.62,31.11 C14.1
  Top Layer w1.27: C13.2 46.58,36.44 45.69,37.33
  Top Layer w1.778: C10.2 C14.1
  Top Layer w1.905: U11.3 43.31,37.33 41.55,35.56 41.55,33.79 38.63,30.86 38.63,29.34
  Top Layer w2.032: L1.2 38.1,27.35 C10.2
  Inner1 w0.813: J4.4 3.58,32.52 3.58,42.93 9.54,48.9 20.47,48.9 21.61,50.04 23.51,50.04 24.02,49.53 24.02,42.93 20.34,39.25 20.34,35.18 24.91,30.61 v2(28.68,30.61)
  Bottom Layer w0.762: 40.66,10.93 40.66,16.39 v1(35.83,21.22) v1(35.83,23.57) ; 40.66,10.93 42.06,9.53 49.42,9.53 50.44,10.54 v2(51.93,10.54) ; 40.66,10.93 38.75,9.02 18.95,9.02 18.06,8.13 6.62,8.13 5.35,6.86 v2(2.56,6.86) v2(2.56,8.53)
  vias: v1(35.83,25.91) v1(35.83,24.74) v1(35.83,22.39) v1(36.98,25.91) v1(36.98,24.74) v1(36.98,23.57) v1(36.98,22.39) v1(36.98,21.22) v3(14.49,48.9)
VIN: length 253.1
  Top Layer w0.381: R2.2 23.39,15.62 24.4,14.61 27.07,14.61 27.71,15.24 27.71,16.61 CN7.1 ; v1(54.88,33.91) 54.38,33.91 52.85,35.44 46.12,35.44 45.52,36.03 43.92,36.03 43.33,35.44 43.33,33.21 43.65,32.89
  Top Layer w0.508: C20.1 43.19,32.43 43.65,32.89
  Top Layer w0.559: R7.1 25.98,28.32 v2(25.29,28.32) ; D1.1 5.8,31.04 C6.1 5.72,30.86 4.97,30.86 4.59,31.24 v2(4.59,31.75)
  Top Layer w0.635: C2.2 27.13,22.81 27.13,24.1
  Top Layer w1.016: C4.2 16.28,28.7
  Top Layer w1.143: 14.37,12.26 14.37,13.21 14.88,13.72 15.83,13.72 16.28,14.17 U1.9 16.28,17.27 ; C18.2 52.34,31.23 52.34,28.7 ; 16.28,28.7 16.28,26.42 16.02,26.42
  Top Layer w1.27: C1.2 C2.2
  Top Layer w1.524: 14.88,26.42 v4(18.18,26.42) 16.02,26.42 ; 13.86,17.91 v4(14.83,17.91) 15.77,17.91 15.77,17.78 16.28,17.27 ; CN7.1 27.74,17.88 26.68,18.94 C1.2
  Top Layer w1.778: 14.37,12.26 14.37,8 15.89,6.48 21.91,6.48 C3.1 ; C5.1 38.46,6.99 44.34,6.99 45.36,8 H11.2
  Inner2 w0.305: 20.72,14.61 20.34,14.61 20.34,25.15 22.62,27.43 27.71,27.43 29.23,25.91 29.23,18.13 27.74,16.64
  Inner2 w0.559: v2(25.29,28.32) 25.29,27.18 ; v2(4.59,31.75) 15.64,31.75 16.02,31.37 16.02,26.42
  Inner2 w1.27: v2(52.34,16.13) v2(52.34,14.86)
  Inner2 w2.032: 13.86,17.91 13.86,25.28 15,26.42 27.07,26.42 27.32,26.67
  Inner2 w2.286: 26.64,7.24 21.99,7.24 20.72,8.51 20.72,14.61 17.93,17.4 14.37,17.4 13.86,17.91
  Inner2 w2.54: 53.74,17.15 55.14,18.54 55.14,31.63 v1(54.88,31.88) ; 35.33,7.24 25.03,7.24
  Inner2 w3.302: v1(34.36,7.87) 37.87,11.38 37.87,14.99 40.02,17.15 53.11,17.15
  Bottom Layer w1.524: 13.86,17.91 13.86,25.15 15.13,26.42 16.02,26.42 ; 15.77,17.91 15.02,18.66 15.02,25.54
  Bottom Layer w2.032: v4(18.18,26.42) 16.02,26.42 ; 16.02,26.42 15.14,25.54 15,25.53 ; 16.02,26.42 14.88,26.42 ; 13.86,17.91 15.77,17.91
  vias: v1(24.06,7.87) v1(24.1,6.55) v1(25.08,7.87) v1(25.11,6.55) v1(26.09,7.87) v1(26.13,6.55) v1(27.11,7.87) v1(27.14,6.55) v1(28.13,7.87) v1(28.16,6.55) v1(29.14,7.87) v1(29.18,6.55) v1(30.29,7.87) v1(30.33,6.55) v1(31.31,7.87) v1(31.34,6.55) v1(32.33,7.87) v1(32.36,6.55) v1(33.34,7.87) v1(33.38,6.55) v1(34.39,6.55) v1(35.37,7.87) v1(35.41,6.55) v1(53.87,33.91) v1(53.87,32.9) v1(53.87,31.88) v1(53.87,30.74) v1(54.88,32.9) v1(54.88,30.74) v1(55.9,33.91) v1(55.9,32.9) v1(55.9,31.88) v1(55.9,30.74) v4(13.61,17.91) v4(14.75,26.42) v4(15.89,26.42) v4(16.02,17.91) v4(17.04,26.42)
BAT_ADC: length 31.2
  Top Layer w0.305: R12.2 21.24,21.07 20.47,21.85 20.47,33.53 19.96,34.04 19.96,39.25 19.07,40.13 19.07,43.44 19.44,43.81 U5.7
  Top Layer w0.762: R12.2 C21.2 R2.1
CN2_1: length 4.5
  Bottom Layer w0.381: CN2.1 27.36,13.12 29.73,15.49 CN7.2
D1_3: length 4.6
  Top Layer w0.381: C11.2 9.28,33.16 8.78,33.66 7.26,33.66 6.75,34.17 D1.3
D3_3: length 3.9
  Top Layer w0.381: C25.2 47.15,34.04 45.23,34.04 44.6,34.67 D3.3
DATA: length 93.1
  Top Layer w0.305: R24.1 v2(54.88,51.18) 54.25,50.55 U3.2 ; v2(50.31,55.12) 49.33,55.12 U10.4
  Inner1 w0.508: 16.91,12.26 16.91,11.18 22.5,5.59 42.56,5.59 47.9,10.92 47.9,12.39
  Bottom Layer w0.305: v2(54.88,51.18) 54.88,54.23 53.74,55.37 50.56,55.37 v2(50.31,55.12)
  Bottom Layer w0.635: 47.9,12.39 47.9,41.28 48.79,42.17 50.31,42.17 54.88,46.74 v2(54.88,51.18)
DTR: length 3.7
  Top Layer w0.305: Q2.2 3.61,38.35 R18.2 5.99,39.36 U7.13
EN: length 25.4
  Top Layer w0.305: U5.3 20.02,48.89 R1.1 19.83,47.32 19.83,44.83 19.7,44.83 18.43,43.56 KEY2.1 16.9,36.71 10.18,36.71 9.31,35.84 Q3.3
  Top Layer w0.381: U5.3 v2(23.01,48.9)
IO0: length 40.3
  Top Layer w0.305: v2(4.72,35.18) 3.21,35.18 Q2.3
  Top Layer w0.381: U5.25 v2(37.74,34.93)
  Inner2 w0.305: v2(37.74,34.93) 36.85,34.04 5.35,34.04 4.72,34.67 v2(4.72,35.18)
IO4: length 61
  Top Layer w0.381: v2(36.09,35.05) 37.22,36.19 U5.26
  Inner2 w0.381: v2(36.09,35.05) 31.26,39.88 28.72,39.88 24.15,44.45 3.32,44.45 0.53,41.66 0.53,26.8 1.54,25.78 J4.2
IO15: length 59.9
  Top Layer w0.381: U5.23 v2(34.82,35.05)
  Inner2 w0.381: J4.1 3.32,24.64 3.32,31.37 1.16,33.53 1.16,41.53 3.45,43.82 23.9,43.82 28.47,39.25 31.13,39.25 34.82,35.56 v2(34.82,35.05)
IO21: length 33.9
  Top Layer w0.381: v2(36.98,45.09) 39.36,45.09 U5.33 ; v2(14.62,41.91) KEY1.1 13.27,38.24 R11.1
  Bottom Layer w0.381: v2(36.98,45.09) 35.58,45.09 33.7,43.21 20.85,43.21 20.49,43.56 16.02,43.56 14.62,42.17 v2(14.62,41.91)
IO34: length 6.9
  Top Layer w0.381: v2(25.8,48.64) 25.8,46.87 24.02,45.09 U5.6
IO36: length 57.2
  Top Layer w0.381: U5.4 v2(23.01,47.63)
  Inner2 w0.381: v2(23.01,47.63) 23.9,46.74 23.9,46.23 28.97,41.15 56.15,41.15 59.33,37.98 59.33,24.64 58.44,23.75 J2.1
IO39: length 53.9
  Top Layer w0.381: U5.5 v2(23.01,46.36)
  Inner2 w0.381: J2.2 57.68,26.29 56.79,27.18 56.79,32.39 58.69,34.29 58.69,37.72 55.9,40.52 28.85,40.52 v2(23.01,46.36)
LED: length 32.9
  Top Layer w0.305: U5.16 25.93,32.26 26.44,31.75 v2(26.82,31.75) ; v2(50.06,44.07) 49.79,44.07 R10.1
  Bottom Layer w0.305: v2(50.06,44.07) 48.28,44.07 43.45,39.25 43.45,37.98 41.8,36.32 31.39,36.32 v2(26.82,31.75)
M0_EN: length 83.7
  Top Layer w0.305: v2(37.74,48.9) U5.36 39.62,48.64 R13.1
  Inner2 w0.33: v2(8.66,15.5) 8.65,13.46 ; v2(15,29.47) 15,30.74 14.62,31.12 4.88,31.12 3.83,30.06 3.83,15.12 5.48,13.46 9.54,13.46 10.43,14.35 14.62,14.35 15,14.73 v2(15,15.5)
  Bottom Layer w0.381: v2(37.74,48.9) 38.12,48.52 38.12,45.09 36.98,43.94 35.33,43.94 34.06,42.67 27.32,42.67 24.28,39.63 24.28,34.17 19.58,29.47 v2(15,29.47)
M0_IN1: length 37
  Top Layer w0.305: U5.8 v2(19.83,42.55)
  Inner1 w0.305: v2(19.83,42.55) 19.32,42.55 18.05,41.28 18.05,39.5 8.78,30.23 8.78,18.04 11.45,15.37 v2(13.74,15.37)
M0_IN2: length 39.3
  Top Layer w0.305: v2(19.83,41.53) 21.11,41.53 U5.9
  Inner1 w0.305: v2(19.83,41.53) 20.59,41.53 20.97,41.91 20.97,43.06 20.47,43.56 19.58,43.56 17.55,41.53 17.55,39.75 8.27,30.48 8.27,17.78 9.93,16.13 v2(9.93,15.37)
M0_IN3: length 15.3
  Top Layer w0.305: v2(19.83,40.52) 20.34,40.52 20.72,40.13 21.23,40.13 U5.10
  Inner1 w0.305: v2(13.74,29.47) 13.74,34.42 v2(19.83,40.52)
M0_OUT1: length 14.5
  Top Layer w0.381: U1.6 12.72,15.5 12.72,17.4 11.45,18.67 1.92,18.67 J1.2
M0_OUT2: length 14.1
  Top Layer w0.381: U1.5 11.19,13.97 9.42,12.19 3.19,12.19 1.42,13.97 1.42,14.35 1.92,14.86 J1.3
M0_OUT3: length 31.9
  Top Layer w1.143: 12.47,28.7 12.47,26.8
  Top Layer w1.524: 12.47,26.8 v1(11.96,26.29) v1(10.81,26.29) v1(9.67,26.29) v1(5.61,26.29)
  Bottom Layer w1.016: v1(10.81,26.29) 8.53,26.29 8.53,21.08 7,19.56 2.56,19.56 J1.1 2.43,20.2 4.46,22.23 4.46,25.15 v1(5.61,26.29)
  vias: v1(6.88,26.29)
M1_EN: length 73
  Top Layer w0.381: v2(23.01,34.93) U5.14 21.24,34.78 R14.1
  Inner1 w0.33: v2(51.07,14.73) 51.08,13.85 ; v2(44.72,14.73) 44.72,14.23 45.1,13.85 53.61,13.85 54.63,14.86 54.63,26.59 51.75,29.47 v2(51.07,29.47)
  Inner1 w0.381: v2(23.01,34.93) 22.88,35.05 22.5,35.05 21.23,36.32 21.23,38.99 22.62,40.39 23.64,40.39 32.28,31.75 43.2,31.75 44.6,30.36 50.31,30.36 51.07,29.59 v2(51.07,29.47)
M1_IN1: length 43.4
  Top Layer w0.381: U5.11 v2(23.01,38.74)
  Inner1 w0.381: v2(49.8,14.73) 49.8,23.37 42.82,30.36 31.77,30.36 23.39,38.74 v2(23.01,38.74)
M1_IN2: length 43.4
  Top Layer w0.381: U5.12 v2(23.01,37.47)
  Inner1 w0.381: v2(45.99,14.73) 45.99,16.39 49.04,19.43 49.04,23.37 42.69,29.72 31.52,29.72 23.77,37.47 v2(23.01,37.47)
M1_IN3: length 37.7
  Top Layer w0.381: U5.13 v2(23.01,36.2)
  Inner1 w0.381: v2(23.01,36.2) 22.24,36.2 21.86,36.58 21.86,38.86 22.62,39.63 23.39,39.63 31.9,31.12 42.94,31.12 44.6,29.47 v2(49.8,29.47)
M1_OUT1: length 14.9
  Top Layer w0.381: U4.6 48.28,15.5 48.28,14.1 49.8,12.58 57.17,12.58 58.57,13.97 58.57,15.12 58.31,15.37 J3.1
M1_OUT2: length 16.6
  Top Layer w0.635: J3.2 58.06,18.29 57.8,18.54 47.39,18.54 47.01,18.16 47.01,15.76 U4.5 47.52,15.75 47.52,17.53
M1_OUT3: length 6.6
  Top Layer w1.143: 48.53,28.7 48.53,26.93
  Top Layer w1.397: v1(50.12,26.29) 49.17,26.29 48.53,26.93
  Top Layer w1.524: v1(53.15,26.29) v1(52.16,26.29) v1(51.15,26.29) v1(50.12,26.29)
Q1_1: length 2.3
  Top Layer w0.305: R23.2 54.07,55.18 Q1.1
R3_2: length 2
  Top Layer w0.305: R3.2 LED1.1
R10_2: length 2
  Top Layer w0.305: LED2.1 R10.2
R17_1: length 3.6
  Top Layer w0.305: Q2.1 3.87,36.07 6.12,36.07 6.5,36.45 6.5,36.84
R18_1: length 6.1
  Top Layer w0.305: R18.1 5.73,37.59 7.13,37.59 7.51,37.21 9.16,37.21 9.86,37.91 9.86,38.34
RTS: length 4.3
  Top Layer w0.305: Q3.2 7.26,39.04 U7.14 7.26,39.11 R17.2
RXD0: length 31.7
  Top Layer w0.381: U5.34 v2(36.98,46.36)
  Inner2 w0.254: v2(11.07,47.75) 12.72,47.75 13.1,47.37 17.93,47.37 20.85,50.29 33.67,50.29 36.09,47.88 36.09,47.25 v2(36.98,46.36)
SCL_0: length 66.5
  Top Layer w0.305: U5.30 39.42,41.21 R5.1
  Top Layer w0.381: v2(37.48,42.04) 38.12,41.4 39.23,41.4 U5.30 ; v2(5.1,8.51) 5.1,10.43 CN3.2
  Bottom Layer w0.381: v2(37.48,42.04) 37.23,42.29 35.71,42.29 34.69,41.28 27.71,41.28 25.67,39.25 25.67,33.78 22.12,30.23 22.12,13.21 17.8,8.89 5.48,8.89 v2(5.1,8.51)
SCL_1: length 53.6
  Top Layer w0.305: R4.1 39.61,39.75 U5.29
  Top Layer w0.381: v2(36.98,38.86) 38.12,40.01 U5.29 ; 55.76,10.44 v2(55.77,8.64)
  Inner1 w0.381: v2(55.77,8.64) 55.77,8.13 55.14,7.5 54.12,7.5 53.11,8.51 53.11,11.56 55.14,13.59 55.14,26.8 50.95,30.99 44.85,30.99 v2(36.98,38.86)
SDA_0: length 68.3
  Top Layer w0.305: R6.1 39.51,42.67 U5.31
  Top Layer w0.381: 3.84,10.44 v2(3.83,8.51) ; v2(37.48,43.06) 37.99,43.06 38.51,42.54 U5.31
  Bottom Layer w0.381: v2(3.83,8.51) 3.83,9.27 4.08,9.53 17.29,9.53 21.36,13.59 21.36,30.23 25.04,33.91 25.04,39.5 27.58,42.04 34.18,42.04 35.33,43.18 37.36,43.18 v2(37.48,43.06)
SDA_1: length 61.7
  Top Layer w0.305: R9.1 41.42,51.56 40.01,50.16 U5.37
  Top Layer w0.381: v2(36.98,50.29) 39.23,50.29 U5.37 ; 54.51,10.44 v2(54.5,8.64)
  Inner1 w0.381: v2(54.5,8.64) 54.5,11.94 55.77,13.21 55.77,26.93 51.07,31.63 45.23,31.63 43.96,32.9 43.96,45.47 39.13,50.29 v2(36.98,50.29)
SERVO_RX: length 19.5
  Top Layer w0.305: v2(41.04,37.59) 39.51,37.59 U5.27 ; R20.1 v2(52.4,47.88) 52.76,47.88 U3.4
  Bottom Layer w0.305: v2(52.4,47.88) 51.2,47.88 42.82,39.5 42.82,39.37 v2(41.04,37.59)
SERVO_TX: length 26.9
  Top Layer w0.305: U10.2 51.07,54.23 50.82,53.98 v2(50.82,52.28) 50.82,51.04 R21.2 ; U5.28 39.49,38.61 v2(41.04,38.61) ; R23.1 53.47,52.98 52.22,54.23 51.87,54.23
  Bottom Layer w0.305: v2(41.04,38.61) 50.82,48.39 v2(50.82,52.28)
TXD0: length 39.8
  Top Layer w0.254: v2(4.59,47.63) 6.12,47.63 R15.1
  Top Layer w0.381: U5.35 v2(36.98,47.63)
  Inner2 w0.254: v2(36.98,47.63) 33.8,50.8 20.59,50.8 17.67,47.88 13.23,47.88 12.47,48.64 5.73,48.64 4.72,47.63 v2(4.59,47.63)
TXEN: length 16
  Top Layer w0.305: 51.87,53.28 52.6,52.55 52.6,49.28 52.85,49.02 55.01,49.02 55.2,49.21 U3.1 56.13,49.01 R22.2 57.55,53.74 Q1.3
U1_16: length 3.8
  Top Layer w0.381: 11.19,28.7 11.45,28.95 11.45,30.48 12.07,31.1 C7.1
U1_17: length 2.5
  Top Layer w0.381: 9.93,28.7 9.93,30.98 C11.1
U1_18: length 4.5
  Top Layer w0.381: D1.2 7.91,32.55 C6.2 8.66,30.24 8.66,28.7
U2_3: length 24.6
  Top Layer w0.254: 31.54,22.99 31.54,23.47 29.36,25.66 28.09,25.66 27.78,24.57 ; L1.1 31.54,22.71 32.78,21.47 33.29,21.47 33.93,22.1 33.93,28.58 33.55,28.96 C12.1
  Top Layer w0.508: C12.1 30,25.91 28.09,25.91 27.78,25.6 27.78,24.57
U2_5: length 3.6
  Top Layer w0.762: 28.59,27.05 28.72,27.31 29.99,27.31 30.99,28.31 30.99,28.96
U2_6: length 2.3
  Top Layer w0.381: R7.2 27.78,28.19 U2.6
U2_7: length 4.9
  Top Layer w0.406: U2.7 27.13,26.22 26.56,25.66 24.52,25.66 C8.2
U2_8: length 7.3
  Top Layer w0.889: 26.18,27.18 26.18,26.85 R8.1 23.58,26.91 21.48,26.91 21.61,26.79 R19.2
U4_16: length 4.5
  Top Layer w0.381: C22.1 48.66,30.23 47.64,30.23 47.26,29.85 U4.16
U4_17: length 3.5
  Top Layer w0.381: C25.1 47.52,31.12 46.25,29.85 46.25,28.95 45.99,28.7
U4_18: length 4.5
  Top Layer w0.381: 45.55,32.89 45.55,31.42 C20.2 45.25,29.22 44.72,28.7
U5_24: length 10.5
  Top Layer w0.305: R26.1 v2(40.91,27.18) ; U5.24 36.48,33.02 v2(37.74,33.02)
  Bottom Layer w0.305: v2(40.91,27.18) 40.91,29.85 v2(37.74,33.02)
U7_2: length 2.1
  Top Layer w0.305: U7.2 9.17,46.57 R16.2
U7_3: length 2
  Top Layer w0.305: U7.3 7.76,46.43 R15.2
U7_4: length 7
  Top Layer w0.406: U7.4 5.99,44.96 7.02,43.93 C23.1
USB2_1: length 5.1
  Top Layer w0.711: D2.2 12.17,48.56 11.83,48.9 7.77,48.9
USB2_2: length 6.8
  Top Layer w0.305: 6.89,50.03 6.89,49.04 6.37,48.52 4.21,48.52 3.45,47.75 U7.6
USB2_3: length 10.9
  Top Layer w0.305: 6.24,50.03 6.24,49.28 5.99,49.02 3.83,49.02 2.81,48.01 2.81,45.09 3.32,44.58 4.34,44.58 4.72,44.96 U7.5

## Copper pours and planes (outline as drawn; the poured copper is in the pictures)
GND on Top Layer: 28.43,25.15 29.36,25.15 29.36,22.35 28.43,22.35
GND on Top Layer: 40.66,47.13 44.05,47.13 44.05,43.44 40.66,43.44
GND on Top Layer: 27.96,20.83 35.83,20.83 35.83,18.42 27.96,18.42
GND on Top Layer: 0.65,51.06 4.84,51.06 4.84,47.25 0.65,47.25
GND on Top Layer: 23.24,23.4 25.31,23.4 25.31,18.04 23.24,18.04
GND on Bottom Layer: -6.14,61.92 -7.92,60.14 -7.92,-10.73 -6.27,-12.38 66.88,-12.38 66.38,-11.87 66.38,63.19
GND on Inner2: -12.3,68.33 -12.3,-4.57 -15.09,-7.36 62.88,-7.36 73.04,2.8 73.04,66.8 72.03,67.82
PGND on Top Layer: 17.04,16.64 21.78,16.64 21.78,13.17 17.04,13.17
PGND on Top Layer: 36.09,16.64 43.96,16.64 43.96,13.04 36.09,13.04
PGND on Top Layer: 47.9,29.72 55.77,29.72 55.77,22.1 47.9,22.1
PGND on Top Layer: 17.29,30.1 19.65,30.1 19.65,27.56 17.29,27.56
PGND on Inner1: 30.75,14.23 33.67,14.23 33.67,11.18 30.75,11.18
PGND on Inner1: 25.8,25.53 45.74,25.53 45.74,8.89 25.8,8.89
PGND on Inner1: 9.8,25.28 26.05,25.28 26.05,8.89 9.8,8.89
VCC-5V on Top Layer: 35.33,30.99 39.64,30.99 39.64,19.94 35.33,19.94
VCC-5V on Bottom Layer: 35.33,26.8 37.48,26.8 37.48,20.58 35.33,20.58
VIN on Top Layer: 23.64,17.88 28.47,17.88 28.47,13.08 23.64,13.08
VIN on Top Layer: 23.77,14.1 26.05,14.1 26.05,8.51 23.77,8.51
VIN on Top Layer: 20.85,8.77 38.88,8.77 38.88,5.21 20.85,5.21
VIN on Top Layer: 51.2,32.39 56.41,32.39 56.41,28.7 51.2,28.7
VIN on Top Layer: 53.23,34.17 56.41,34.17 56.41,31.75 53.23,31.75
VIN on Top Layer: 26.05,24.57 27.32,24.57 27.32,22.35 26.05,22.35
VIN on Inner2: 24.1,11.38 37.87,11.38 37.87,6.55 24.1,6.55
VIN on Inner2: 53.23,34.42 56.41,34.42 56.41,30.1 53.23,30.1
VIN on Inner2: 20.72,14.61 26.18,14.61 26.18,7.87 20.72,7.87
VIN on Inner2: 47.9,23.62 55.14,23.62 55.14,17.15 47.9,17.15
VIN on Inner2: 20.21,27.43 29.23,27.43 29.23,14.23 20.21,14.23
(no net) on Top Layer: -0.62,56.9 2.18,56.9 2.18,49.41 -0.62,49.41
(no net) on Top Layer: 10.31,56.64 12.34,56.64 12.34,49.66 10.31,49.66
CN2_1 on Bottom Layer: 25.93,18.04 30.75,18.04 30.75,11.69 25.93,11.69
CN2_1 on Inner1: 25.93,18.04 30.75,18.04 30.75,12.19 25.93,12.19
CN2_1 on Inner2: 25.93,18.04 30.75,18.04 30.75,11.69 25.93,11.69
M0_OUT1 on Top Layer: 1.92,18.54 12.72,18.54 12.72,15.5 1.92,15.5
M0_OUT2 on Top Layer: 1.35,15.75 11.58,15.75 11.58,12.19 1.35,12.19
M0_OUT3 on Bottom Layer: 1.92,27.05 12.72,27.05 12.72,19.31 1.92,19.31
M0_OUT3 on Bottom Layer: 0.53,21.4 3.64,21.4 3.64,19.05 0.53,19.05
M1_OUT1 on Top Layer: 48.28,16.26 59.2,16.26 59.2,12.58 48.28,12.58
M1_OUT2 on Top Layer: 47.01,18.54 58.69,18.54 58.69,16.89 47.01,16.89
M1_OUT3 on Bottom Layer: 49.55,26.93 58.82,26.93 58.82,19.56 49.55,19.56
U2_3 on Top Layer: 29.48,28.96 33.93,28.96 33.93,21.47 29.48,21.47
U2_3 on Top Layer: 27.78,26.04 30.6,26.04 30.6,25.57 27.78,25.57
USB2_1 on Top Layer: 7.26,50.8 8.15,50.8 8.15,48.52 7.26,48.52

Small or netless copper shapes (teardrops, artwork), in the pictures only: 2 on Top Layer

## Text on the board
Bottom Silkscreen Layer: GND | VIN | DATA | 5V SDA SCL G | IIC-0 | IIC-1 | 5V | IO4 | IO15 | IO39 | IO36 | ONLY | BLDC | M2 | ESP32 WROOM 32 | - | + | 7-9V
Top Silkscreen Layer: WIFI WEB CONTROL SUPPORT | POWER | GPIO | ESP32-KEY | IO34 | BLDC | 5V SDA SCL G | BLDC ONLY | ESP32 | IO13 | WLROBOT | MUJI | IO21 | EN | OFF
